# Altium project locker.PrjPcb
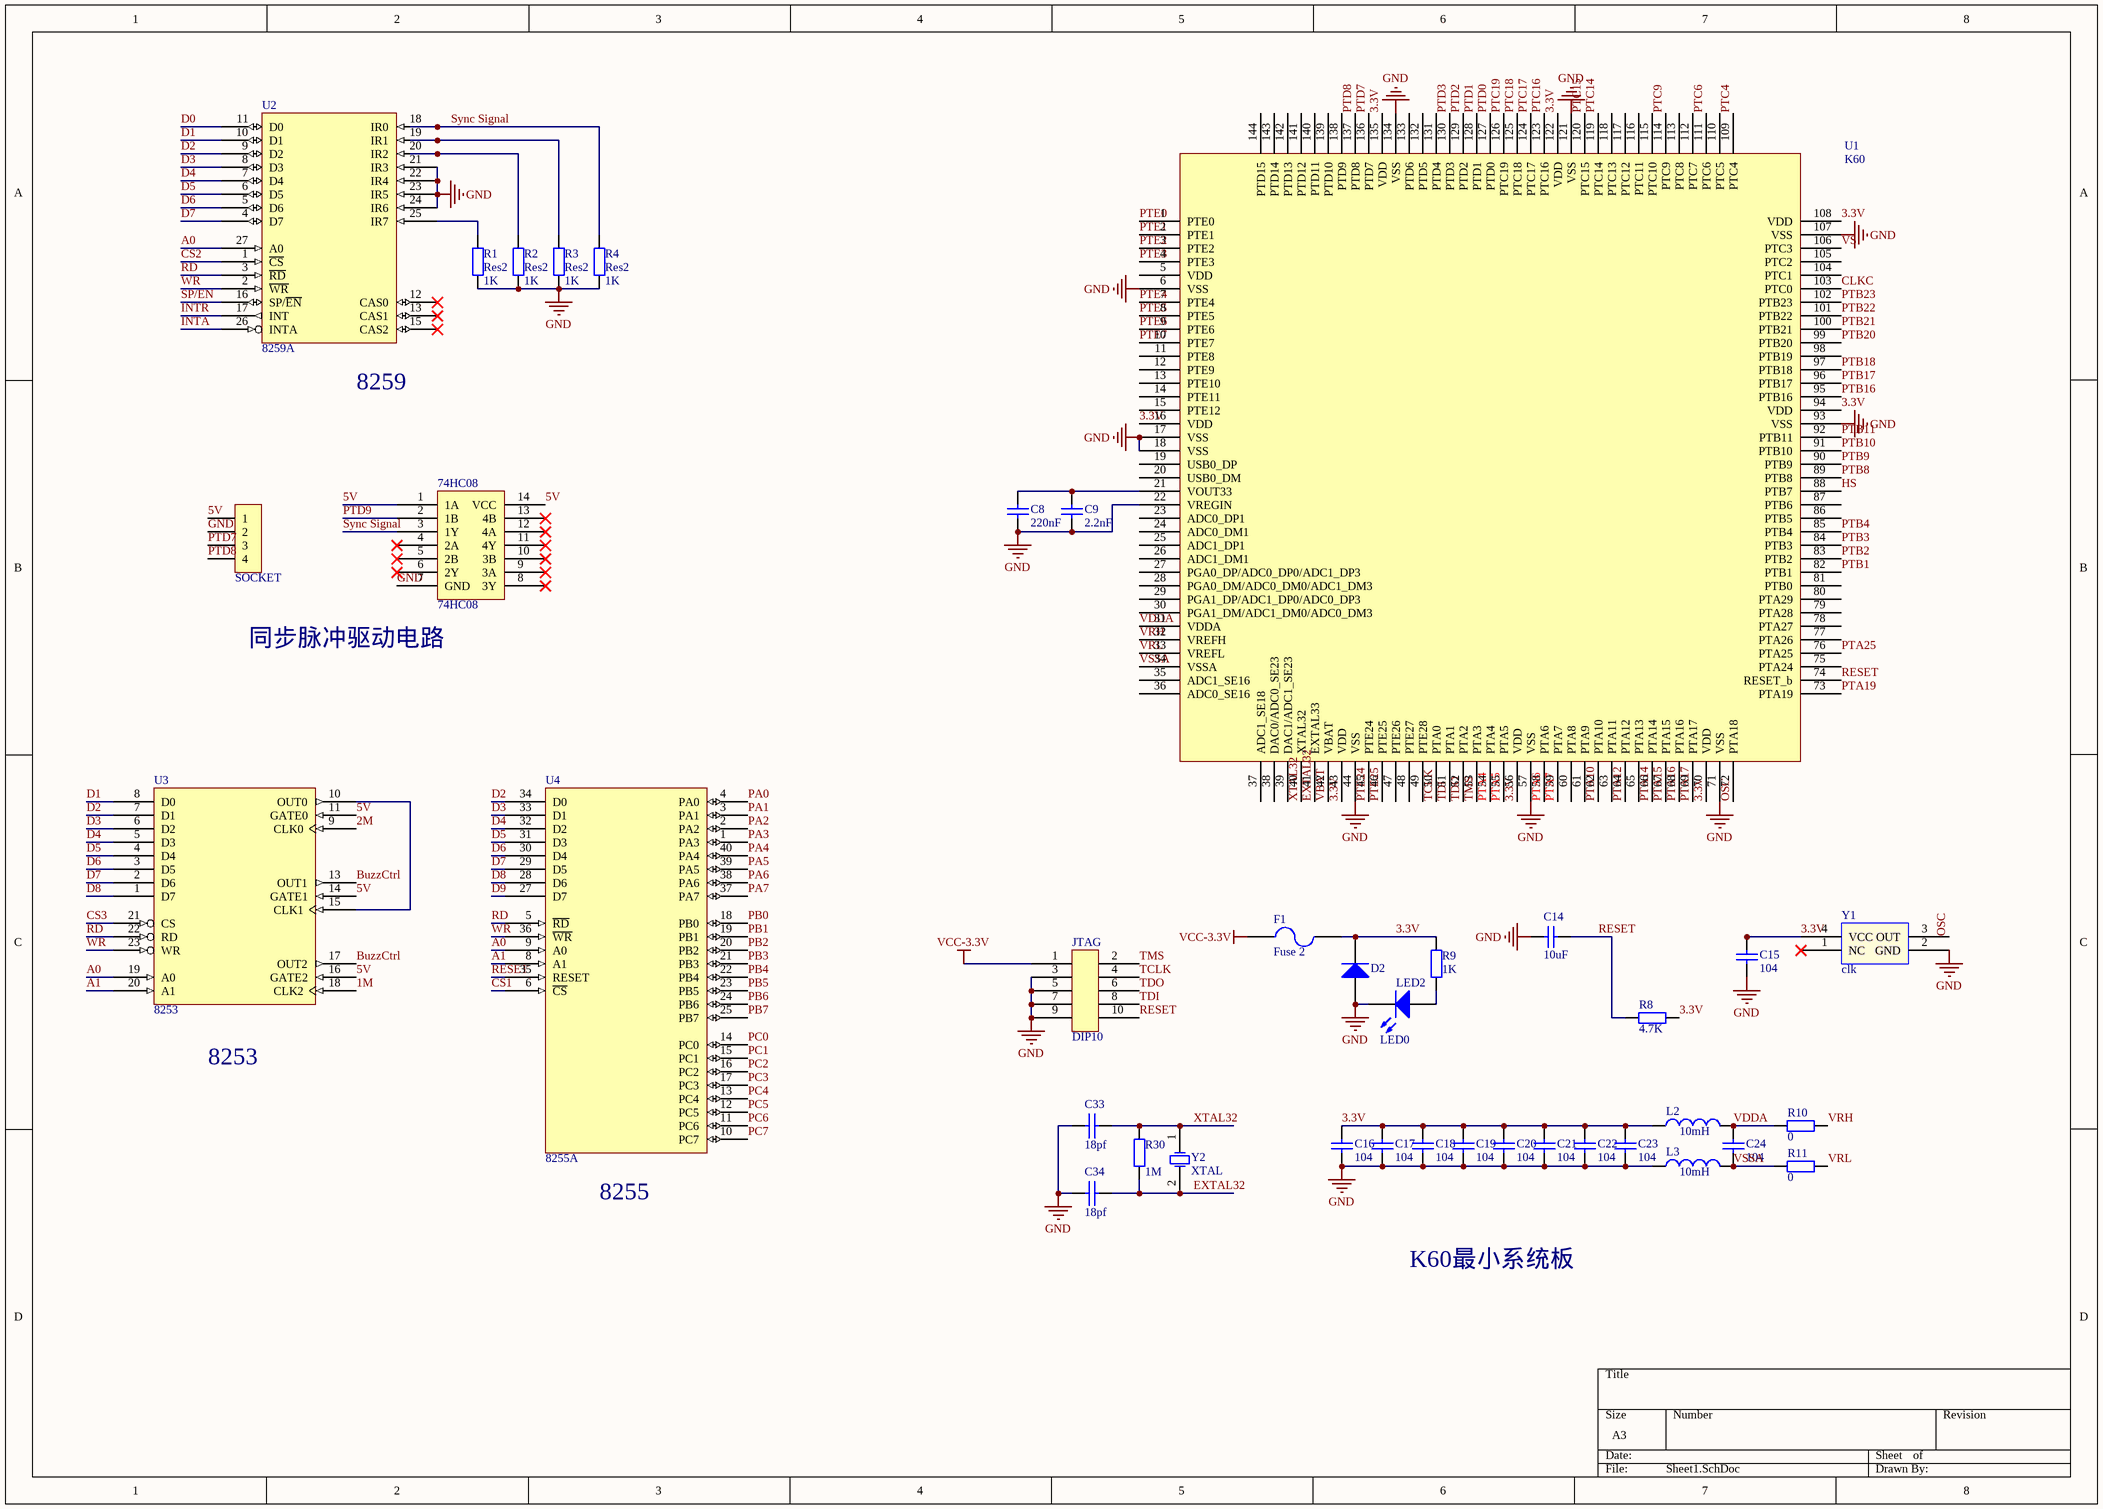
[diagram p0: Sheet1.SchDoc]
1 sheet, 38 parts. Net scope: global (net labels, ports and power ports of the same name join across sheets).

## Sheet Sheet1.SchDoc
size A3

### Parts
74HC08  74HC08  [SO-14]
C8  value 220nF  [0603]  (hidden comment: Cap1)
C9  value 2.2nF  [0603]  (hidden comment: Cap1)
C14  value 10uF  [0603]  (hidden comment: Cap1)
C15  value 104  [0603]  (hidden comment: Cap1)
C16  value 104  [0603]  (hidden comment: Cap1)
C17  value 104  [0603]  (hidden comment: Cap1)
C18  value 104  [0603]  (hidden comment: Cap1)
C19  value 104  [0603]  (hidden comment: Cap1)
C20  value 104  [0603]  (hidden comment: Cap1)
C21  value 104  [0603]  (hidden comment: Cap1)
C22  value 104  [0603]  (hidden comment: Cap1)
C23  value 104  [0603]  (hidden comment: Cap1)
C24  value 104  [0603]  (hidden comment: Cap1)
C33  18pf  [0603]
C34  18pf  [0603]
D2  Diode  [1206]  (value not drawn)
F1  Fuse 2  [1206]
JTAG  DIP10  [IDC-10]
L2  value 10mH  [0805]  (hidden comment: Inductor)
L3  value 10mH  [0805]  (hidden comment: Inductor)
LED2  LED0  [0603]
R1  Res2  value 1K  [AXIAL-0.4]
R2  Res2  value 1K  [AXIAL-0.4]
R3  Res2  value 1K  [AXIAL-0.4]
R4  Res2  value 1K  [AXIAL-0.4]
R8  value 4.7K  [0603]  (hidden comment: Res2)
R9  value 1K  [0603]  (hidden comment: Res2)
R10  value 0  [0603]  (hidden comment: Res2)
R11  value 0  [0603]  (hidden comment: Res2)
R30  value 1M  [0603]  (hidden comment: Res2)
U1  K60  [K60_QFP144]
U2  8259A
U3  8253  [DIP-24]
U4  8255A  [DIP-40]
Y1  clk  [5032]
Y2  XTAL  [晶振-壳]
YY  SOCKET  [SIP4]

### Nets
GND: 74HC08.7(GND) C8.1 C9.1 C14.1 C15.2 C16.2 C17.2 C18.2 C19.2 C20.2 C21.2 C22.2 C23.2 C33.1 C34.1 D2.1(A) JTAG.3 JTAG.5 JTAG.7 JTAG.9 L3.1 LED2.2(K) R1.1 R2.1 R3.1 R4.1 U1.6(VSS) U1.17(VSS) U1.18(VSS) U1.22(VREGIN) U1.44(VSS) U1.57(VSS) U1.71(VSS) U1.93(VSS) U1.107(VSS) U1.121(VSS) U1.134(VSS) U2.14(GND) U2.21(IR3) U2.22(IR4) U2.23(IR5) U2.24(IR6) U3.12(GND) U4.7(GND) Y1.2(GND) YY.2
VCC: U2.28(VCC) U3.24(VCC) U4.26(VCC)
VCC-3.3V: F1.1 JTAG.1
1M: U3.18(CLK2)
2M: U3.9(CLK0)
3.3V: C15.1 C16.1 C17.1 C18.1 C19.1 C20.1 C21.1 C22.1 C23.1 D2.2(K) F1.2 L2.1 R8.1 R9.1 U1.16(VDD) U1.43(VDD) U1.56(VDD) U1.70(VDD) U1.94(VDD) U1.108(VDD) U1.122(VDD) U1.135(VDD) Y1.4(VCC)
5V: 74HC08.1(1A) 74HC08.14(VCC) U3.11(GATE0) U3.14(GATE1) U3.16(GATE2) YY.1
A0: U2.27(A0) U3.19(A0) U4.9(A0)
A1: U3.20(A1) U4.8(A1)
BuzzCtrl: U3.13(OUT1) U3.17(OUT2)
CLKC: U1.103(PTC0)
CS1: U4.6(~{CS})
CS2: U2.1(~{CS})
CS3: U3.21(CS)
D0: U2.11(D0)
D1: U2.10(D1) U3.8(D0)
D2: U2.9(D2) U3.7(D1) U4.34(D0)
D3: U2.8(D3) U3.6(D2) U4.33(D1)
D4: U2.7(D4) U3.5(D3) U4.32(D2)
D5: U2.6(D5) U3.4(D4) U4.31(D3)
D6: U2.5(D6) U3.3(D5) U4.30(D4)
D7: U2.4(D7) U3.2(D6) U4.29(D5)
D8: U3.1(D7) U4.28(D6)
D9: U4.27(D7)
EXTAL32: C34.2 R30.1 U1.41(EXTAL33) Y2.2(OSC2)
HS: U1.88(PTB7)
INTA: U2.26(INTA)
INTR: U2.17(INT)
OSC: U1.72(PTA18) Y1.3(OUT)
PA0: U4.4(PA0)
PA1: U4.3(PA1)
PA2: U4.2(PA2)
PA3: U4.1(PA3)
PA4: U4.40(PA4)
PA5: U4.39(PA5)
PA6: U4.38(PA6)
PA7: U4.37(PA7)
PB0: U4.18(PB0)
PB1: U4.19(PB1)
PB2: U4.20(PB2)
PB3: U4.21(PB3)
PB4: U4.22(PB4)
PB5: U4.23(PB5)
PB6: U4.24(PB6)
PB7: U4.25(PB7)
PC0: U4.14(PC0)
PC1: U4.15(PC1)
PC2: U4.16(PC2)
PC3: U4.17(PC3)
PC4: U4.13(PC4)
PC5: U4.12(PC5)
PC6: U4.11(PC6)
PC7: U4.10(PC7)
PTA4: U1.54(PTA4)
PTA5: U1.55(PTA5)
PTA6: U1.58(PTA6)
PTA7: U1.59(PTA7)
PTA10: U1.62(PTA10)
PTA12: U1.64(PTA12)
PTA14: U1.66(PTA14)
PTA15: U1.67(PTA15)
PTA16: U1.68(PTA16)
PTA17: U1.69(PTA17)
PTA19: U1.73(PTA19)
PTA25: U1.76(PTA25)
PTB1: U1.82(PTB1)
PTB2: U1.83(PTB2)
PTB3: U1.84(PTB3)
PTB4: U1.85(PTB4)
PTB8: U1.89(PTB8)
PTB9: U1.90(PTB9)
PTB10: U1.91(PTB10)
PTB11: U1.92(PTB11)
PTB16: U1.95(PTB16)
PTB17: U1.96(PTB17)
PTB18: U1.97(PTB18)
PTB20: U1.99(PTB20)
PTB21: U1.100(PTB21)
PTB22: U1.101(PTB22)
PTB23: U1.102(PTB23)
PTC4: U1.109(PTC4)
PTC6: U1.111(PTC6)
PTC9: U1.114(PTC9)
PTC14: U1.119(PTC14)
PTC15: U1.120(PTC15)
PTC16: U1.123(PTC16)
PTC17: U1.124(PTC17)
PTC18: U1.125(PTC18)
PTC19: U1.126(PTC19)
PTD0: U1.127(PTD0)
PTD1: U1.128(PTD1)
PTD2: U1.129(PTD2)
PTD3: U1.130(PTD3)
PTD7: U1.136(PTD7) YY.3
PTD8: U1.137(PTD8) YY.4
PTD9: 74HC08.2(1B)
PTE0: U1.1(PTE0)
PTE1: U1.2(PTE1)
PTE2: U1.3(PTE2)
PTE3: U1.4(PTE3)
PTE4: U1.7(PTE4)
PTE5: U1.8(PTE5)
PTE6: U1.9(PTE6)
PTE7: U1.10(PTE7)
PTE24: U1.45(PTE24)
PTE25: U1.46(PTE25)
RD: U2.3(~{RD}) U3.22(RD) U4.5(~{RD})
RESET: C14.2 JTAG.10 R8.2 U1.74(RESET_b) U4.35(RESET)
SP/EN: U2.16(SP/~{EN})
Sync Signal: 74HC08.3(1Y) R4.2 U2.18(IR0)
TCLK: JTAG.4 U1.50(PTA0)
TDI: JTAG.8 U1.51(PTA1)
TDO: JTAG.6 U1.52(PTA2)
TMS: JTAG.2 U1.53(PTA3)
VBAT: U1.42(VBAT)
VDDA: C24.1 L2.2 R10.2 U1.31(VDDA)
VRH: R10.1 U1.32(VREFH)
VRL: R11.1 U1.33(VREFL)
VS: U1.106(PTC3)
VSSA: C24.2 L3.2 R11.2 U1.34(VSSA)
WR: U2.2(~{WR}) U3.23(WR) U4.36(~{WR})
XTAL32: C33.2 R30.2 U1.40(XTAL32) Y2.1(OSC1)
NetC8_2: C8.2 C9.2 U1.21(VOUT33)
NetLED2_1: LED2.1(A) R9.2
NetR1_2: R1.2 U2.25(IR7)
NetR2_2: R2.2 U2.20(IR2)
NetR3_2: R3.2 U2.19(IR1)
NetU3_10: U3.10(OUT0) U3.15(CLK1)

Not connected (* = marked no-connect by the designer): 74HC08 4(2A)* 5(2B)* 6(2Y)* 8(3Y)* 9(3A)* 10(3B)* 11(4Y)* 12(4A)* 13(4B)*; U1 5(VDD) 11(PTE8) 12(PTE9) 13(PTE10) 14(PTE11) 15(PTE12) 19(USB0_DP) 20(USB0_DM) 23(ADC0_DP1) 24(ADC0_DM1) 25(ADC1_DP1) 26(ADC1_DM1) 27(PGA0_DP/ADC0_DP0/ADC1_DP3) 28(PGA0_DM/ADC0_DM0/ADC1_DM3) 29(PGA1_DP/ADC1_DP0/ADC0_DP3) 30(PGA1_DM/ADC1_DM0/ADC0_DM3) 35(ADC1_SE16) 36(ADC0_SE16) 37(ADC1_SE18) 38(DAC0/ADC0_SE23) 39(DAC1/ADC1_SE23) 47(PTE26) 48(PTE27) 49(PTE28) 60(PTA8) 61(PTA9) 63(PTA11) 65(PTA13) 75(PTA24) 77(PTA26) 78(PTA27) 79(PTA28) 80(PTA29) 81(PTB0) 86(PTB5) 87(PTB6) 98(PTB19) 104(PTC1) 105(PTC2) 110(PTC5) 112(PTC7) 113(PTC8) 115(PTC10) 116(PTC11) 117(PTC12) 118(PTC13) 131(PTD4) 132(PTD5) 133(PTD6) 138(PTD9) 139(PTD10) 140(PTD11) 141(PTD12) 142(PTD13) 143(PTD14) 144(PTD15); U2 12(CAS0)* 13(CAS1)* 15(CAS2)*; Y1 1(NC)*

### Notes on the sheet
- (near U2) 8259
- 同步脉冲驱动电路
- 8253
- (near U4) 8255
- K60最小系统板

### Library data of the parts
C8 C9 C14-C24 = Cap1: Capacitor; Published: 8-Jun-2000; LatestRevisionDate: 17-Jul-2002; LatestRevisionNote: Re-released for DXP Platform.; PackageReference: RAD-0.3; Publisher: Altium Limited
C33 C34 = CAP: Capacitor
D2 = Diode: Default Diode; Published: 8-Jun-2000; LatestRevisionDate: 17-Jul-2002; LatestRevisionNote: Re-released for DXP Platform.; PackageVersion: Sep-1996; PackageReference: SMC; Publisher: Altium Limited; PackageDescription: DO-214-AB/SMC; 2 C-Bend Leads; Body 7.9 x 5.9 mm, inc. leads (LxW); Code_JEDEC: DO-214-AB
F1 = Fuse 2: Fuse; Published: 8-Jun-2000; LatestRevisionDate: 17-Jul-2002; LatestRevisionNote: Re-released for DXP Platform.; PackageReference: PIN-W2/E2.8; Publisher: Altium Limited; PackageDescription: Thru-Hole; 2 Leads
L2 L3 = Inductor: Code_IEC: 1005; Published: 8-Jun-2000; LatestRevisionDate: 29-May-2009; LatestRevisionNote: IPC-7351 Footprint Added.; PackageReference: 0402-A; Publisher: Altium Limited; PackageDescription: Chip Inductor; Code_JEITA: 0402
LED2 = LED0: Typical INFRARED GaAs LED; Published: 8-Jun-2000; LatestRevisionDate: 08-Jul-2005; LatestRevisionNote: Mech Layer 1 removed.; PackageReference: LED-0; Publisher: Altium Limited; PackageDescription: LED; 2 Leads
R1-R4 R8-R11 R30 = Res2: Resistor; Published: 8-Jun-2000; LatestRevisionDate: 17-Jul-2002; LatestRevisionNote: Re-released for DXP Platform.; PackageReference: AXIAL-0.4; Publisher: Altium Limited
  R1-R4: PackageDescription: Axial Device, Thru-Hole; 2 Leads; 0.4 in Pin Spacing
Y2 = XTAL: Crystal Oscillator; Published: 8-Jun-2000; LatestRevisionDate: 17-Jul-2002; LatestRevisionNote: Re-released for DXP Platform.; PackageReference: R38; Publisher: Altium Limited
YY = CON4